# Altium schematic sheet IP23151_IP2315.schdoc
size 124 x 101 mm
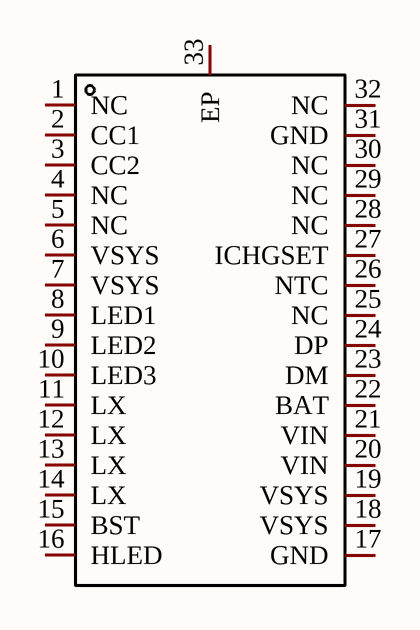
[diagram p0: IP23151_IP2315.schdoc]

## Parts
U?  IP2315  [QFN-32_L5.0-W5.0-P0.50-BL-EP3.4]  (value not drawn)

## Nets

Not connected (* = marked no-connect by the designer): U? 1(NC) 2(CC1) 3(CC2) 4(NC) 5(NC) 6(VSYS) 7(VSYS) 8(LED1) 9(LED2) 10(LED3) 11(LX) 12(LX) 13(LX) 14(LX) 15(BST) 16(HLED) 17(GND) 18(VSYS) 19(VSYS) 20(VIN) 21(VIN) 22(BAT) 23(DM) 24(DP) 25(NC) 26(NTC) 27(ICHGSET) 28(NC) 29(NC) 30(NC) 31(GND) 32(NC) 33(EP)

## Library data of the parts
U? = IP2315: Manufacturer: INJOINIC(英集芯); Add into BOM: yes; Name: IP2315; Symbol: IP2315; Device: IP2315; LCSC Part Name: IP2315; Supplier Part: C2764357; Manufacturer Part: IP2315; Supplier Footprint: QFN-32-EP(5x5); JLCPCB Part Class: Extended Part; Supplier: LCSC; Convert to PCB: yes